# EAGLE design atmega TQFP32 to DIP28 (EAGLE 6.1)
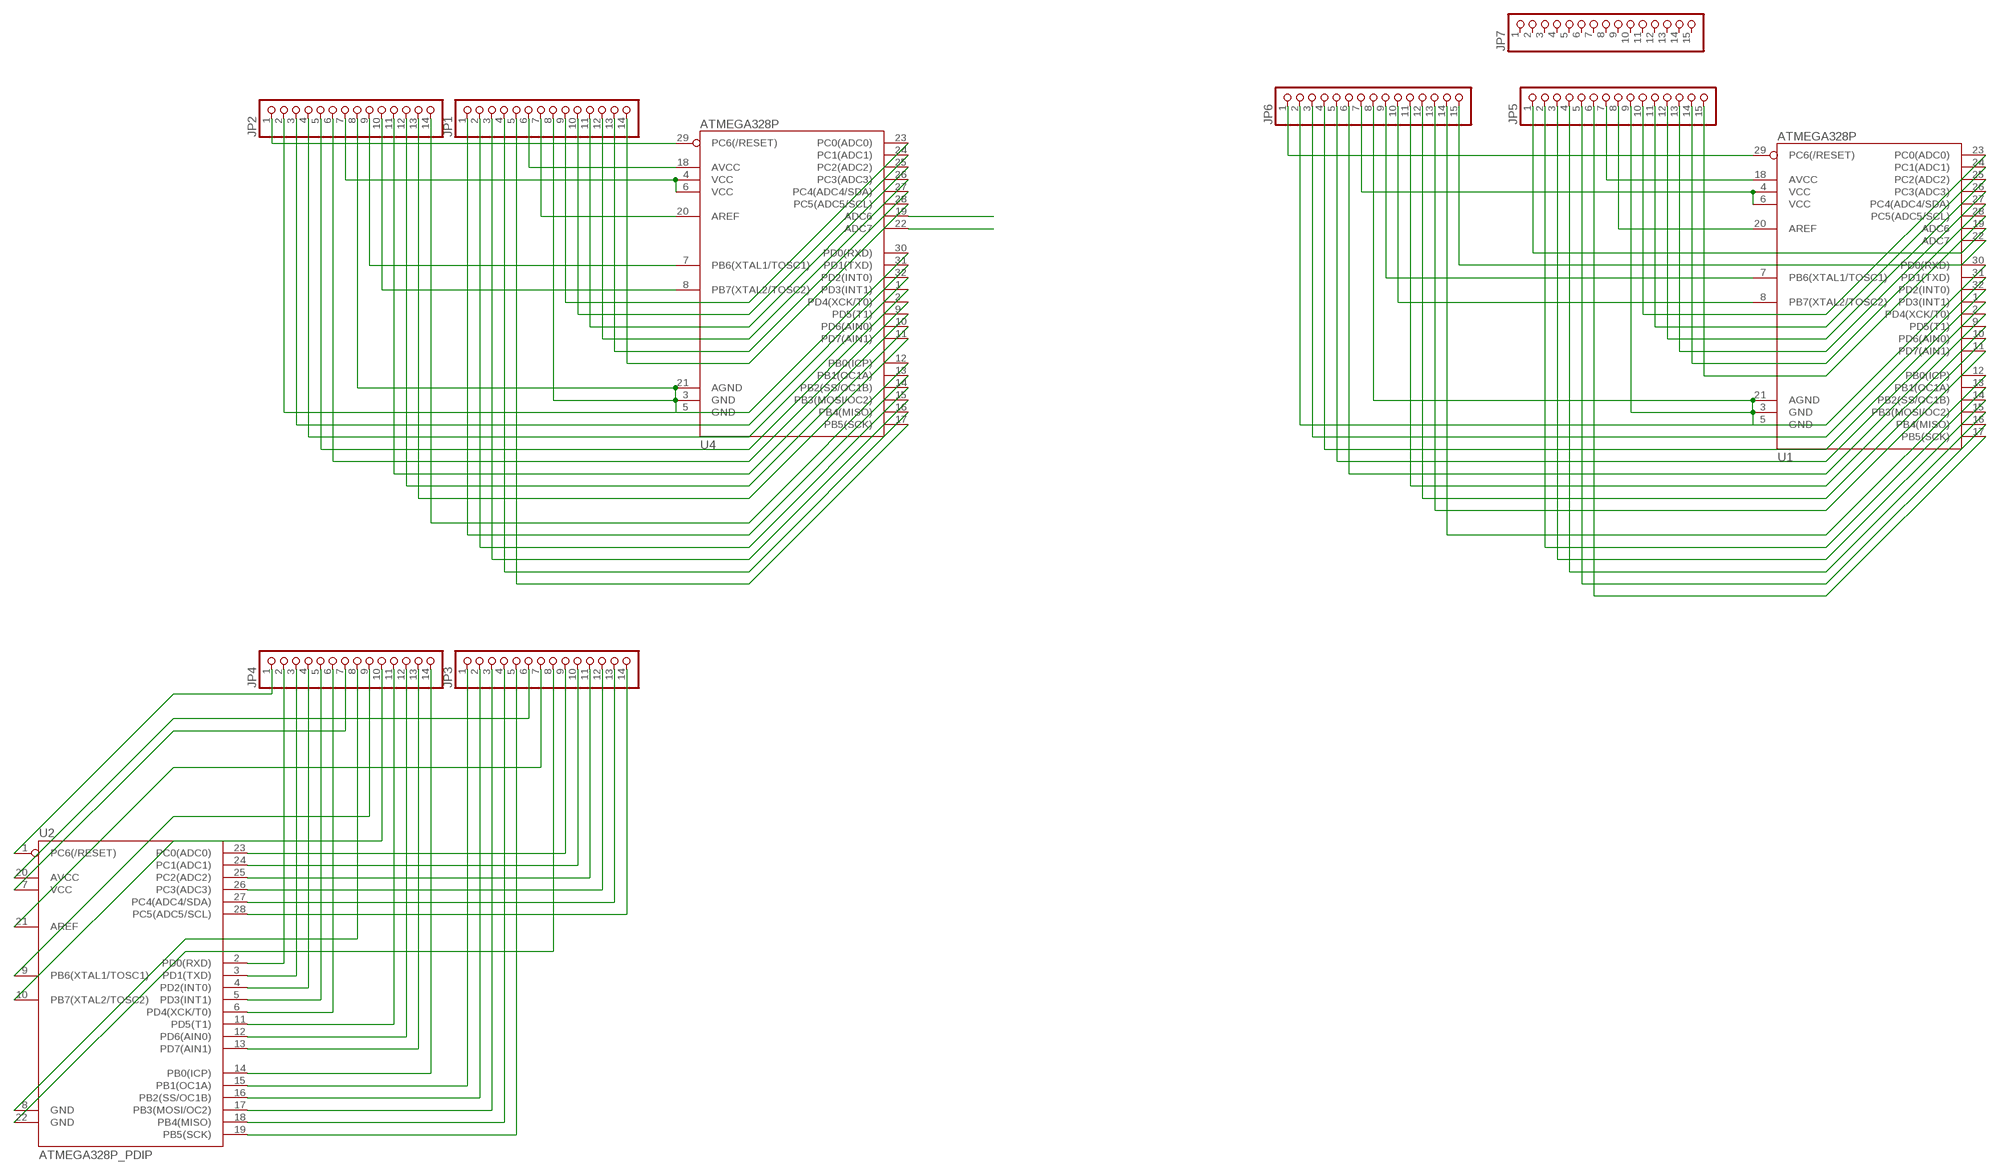
[diagram p0: schematic, sheet 1]

## Parts
JP1  PINHD-1X14  [1X14]
JP2  PINHD-1X14  [1X14]
JP3  PINHD-1X14  [1X14]
JP4  PINHD-1X14  [1X14]
JP5  PINHD-1X15  [1X15]
JP6  PINHD-1X15  [1X15]
JP7  PINHD-1X15  [1X15]
U1  ATMEGA328P  ATMEGA328_SMT  [TQFP32-08]
U2  ATMEGA328P_PDIP  [DIL28-3]
U4  ATMEGA328P  ATMEGA328_SMT  [TQFP32-08]

## Nets
GND: JP1.8 JP2.8 U4.3(GND) U4.5(GND) U4.21(AGND)
GND1: JP5.9 JP6.8 U1.3(GND) U1.5(GND) U1.21(AGND)
N$1: JP2.1 U4.29(PC6(/RESET))
N$2: JP1.6 U4.18(AVCC)
N$3: U4.19(ADC6)
N$4: JP1.7 U4.20(AREF)
N$5: JP2.9 U4.7(PB6(XTAL1/TOSC1))
N$6: JP2.10 U4.8(PB7(XTAL2/TOSC2))
N$7: JP4.1 U2.1(PC6(/RESET))
N$8: U4.22(ADC7)
N$9: JP1.9 U4.23(PC0(ADC0))
N$10: JP1.10 U4.24(PC1(ADC1))
N$11: JP1.11 U4.25(PC2(ADC2))
N$12: JP1.12 U4.26(PC3(ADC3))
N$13: JP1.13 U4.27(PC4(ADC4/SDA))
N$14: JP1.14 U4.28(PC5(ADC5/SCL))
N$15: JP2.2 U4.30(PD0(RXD))
N$16: JP2.3 U4.31(PD1(TXD))
N$17: JP2.4 U4.32(PD2(INT0))
N$18: JP2.5 U4.1(PD3(INT1))
N$19: JP2.6 U4.2(PD4(XCK/T0))
N$20: JP2.11 U4.9(PD5(T1))
N$21: JP2.12 U4.10(PD6(AIN0))
N$22: JP2.13 U4.11(PD7(AIN1))
N$23: JP2.14 U4.12(PB0(ICP))
N$24: JP1.1 U4.13(PB1(OC1A))
N$25: JP1.2 U4.14(PB2(SS/OC1B))
N$26: JP1.3 U4.15(PB3(MOSI/OC2))
N$27: JP1.4 U4.16(PB4(MISO))
N$28: JP1.5 U4.17(PB5(SCK))
N$29: JP3.6 U2.20(AVCC)
N$30: JP4.7 U2.7(VCC)
N$31: JP3.7 U2.21(AREF)
N$32: JP4.9 U2.9(PB6(XTAL1/TOSC1))
N$33: JP4.10 U2.10(PB7(XTAL2/TOSC2))
N$34: JP4.8 U2.8(GND)
N$35: JP3.9 U2.23(PC0(ADC0))
N$36: JP3.10 U2.24(PC1(ADC1))
N$37: JP3.11 U2.25(PC2(ADC2))
N$38: JP3.12 U2.26(PC3(ADC3))
N$39: JP3.13 U2.27(PC4(ADC4/SDA))
N$40: JP3.14 U2.28(PC5(ADC5/SCL))
N$41: JP4.2 U2.2(PD0(RXD))
N$42: JP4.3 U2.3(PD1(TXD))
N$43: JP4.4 U2.4(PD2(INT0))
N$44: JP4.5 U2.5(PD3(INT1))
N$45: JP4.6 U2.6(PD4(XCK/T0))
N$46: JP4.11 U2.11(PD5(T1))
N$47: JP4.12 U2.12(PD6(AIN0))
N$48: JP4.13 U2.13(PD7(AIN1))
N$49: JP4.14 U2.14(PB0(ICP))
N$50: JP3.1 U2.15(PB1(OC1A))
N$51: JP3.2 U2.16(PB2(SS/OC1B))
N$52: JP3.3 U2.17(PB3(MOSI/OC2))
N$53: JP3.4 U2.18(PB4(MISO))
N$54: JP3.5 U2.19(PB5(SCK))
N$55: JP6.1 U1.29(PC6(/RESET))
N$56: JP5.7 U1.18(AVCC)
N$57: JP5.8 U1.20(AREF)
N$58: JP6.9 U1.7(PB6(XTAL1/TOSC1))
N$59: JP6.10 U1.8(PB7(XTAL2/TOSC2))
N$60: JP5.10 U1.23(PC0(ADC0))
N$61: JP5.11 U1.24(PC1(ADC1))
N$62: JP5.12 U1.25(PC2(ADC2))
N$63: JP5.13 U1.26(PC3(ADC3))
N$64: JP5.14 U1.27(PC4(ADC4/SDA))
N$65: JP5.15 U1.28(PC5(ADC5/SCL))
N$66: JP6.2 U1.30(PD0(RXD))
N$67: JP6.3 U1.31(PD1(TXD))
N$68: JP6.4 U1.32(PD2(INT0))
N$69: JP6.5 U1.1(PD3(INT1))
N$70: JP6.6 U1.2(PD4(XCK/T0))
N$71: JP6.11 U1.9(PD5(T1))
N$72: JP6.12 U1.10(PD6(AIN0))
N$73: JP6.13 U1.11(PD7(AIN1))
N$74: JP6.14 U1.12(PB0(ICP))
N$75: JP5.2 U1.13(PB1(OC1A))
N$76: JP5.3 U1.14(PB2(SS/OC1B))
N$77: JP5.4 U1.15(PB3(MOSI/OC2))
N$78: JP5.5 U1.16(PB4(MISO))
N$79: JP5.6 U1.17(PB5(SCK))
N$80: JP5.1 U1.19(ADC6)
N$81: JP6.15 U1.22(ADC7)
N$82: JP3.8 U2.22(GND)
VCC: JP2.7 U4.4(VCC) U4.6(VCC)
VCC1: JP6.7 U1.4(VCC) U1.6(VCC)
Unconnected: JP7.1 JP7.2 JP7.3 JP7.4 JP7.5 JP7.6 JP7.7 JP7.8 JP7.9 JP7.10 JP7.11 JP7.12 JP7.13 JP7.14 JP7.15

## Library data of the parts
JP1-JP4 = pinhead:PINHD-1X14: PIN HEADER
JP5-JP7 = pinhead:PINHD-1X15: PIN HEADER
U1 U4 = SparkFun-DigitalIC:ATMEGA328_SMT: 32-Pin Atmega328 part Commonly used on Arduino compatible boards Available in QFP and QFN packages TQFP is IC-09069 QFN is non-stock; PROD_ID: IC-09069
U2 = SparkFun-DigitalIC:ATMEGA328P_PDIP: uC used in the Arduino 32kb flash, 1k EEPROM, 2k SRAM This is the through-hole version of this chip.

## Board
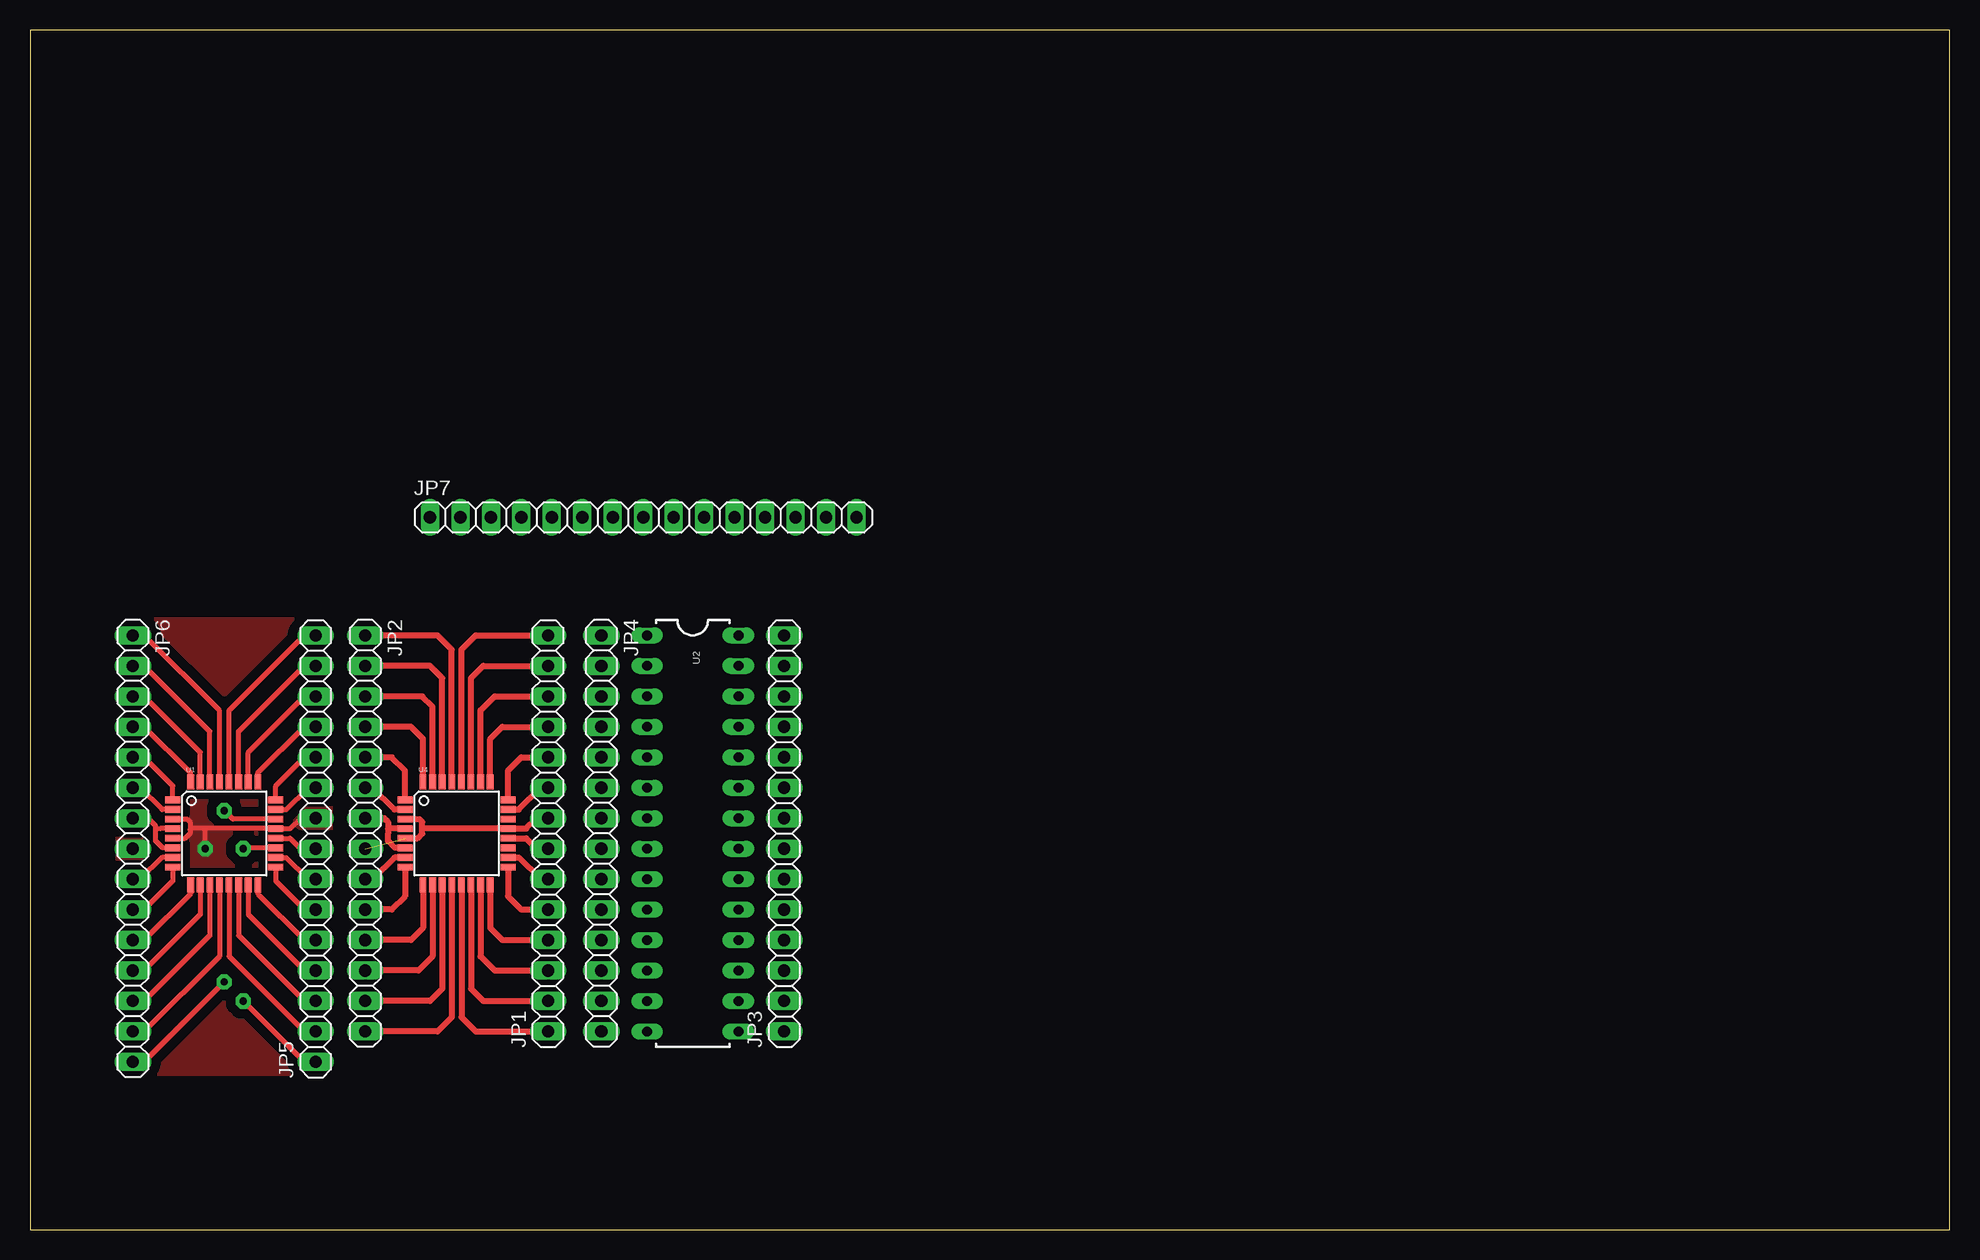
[diagram p1: board, top side]
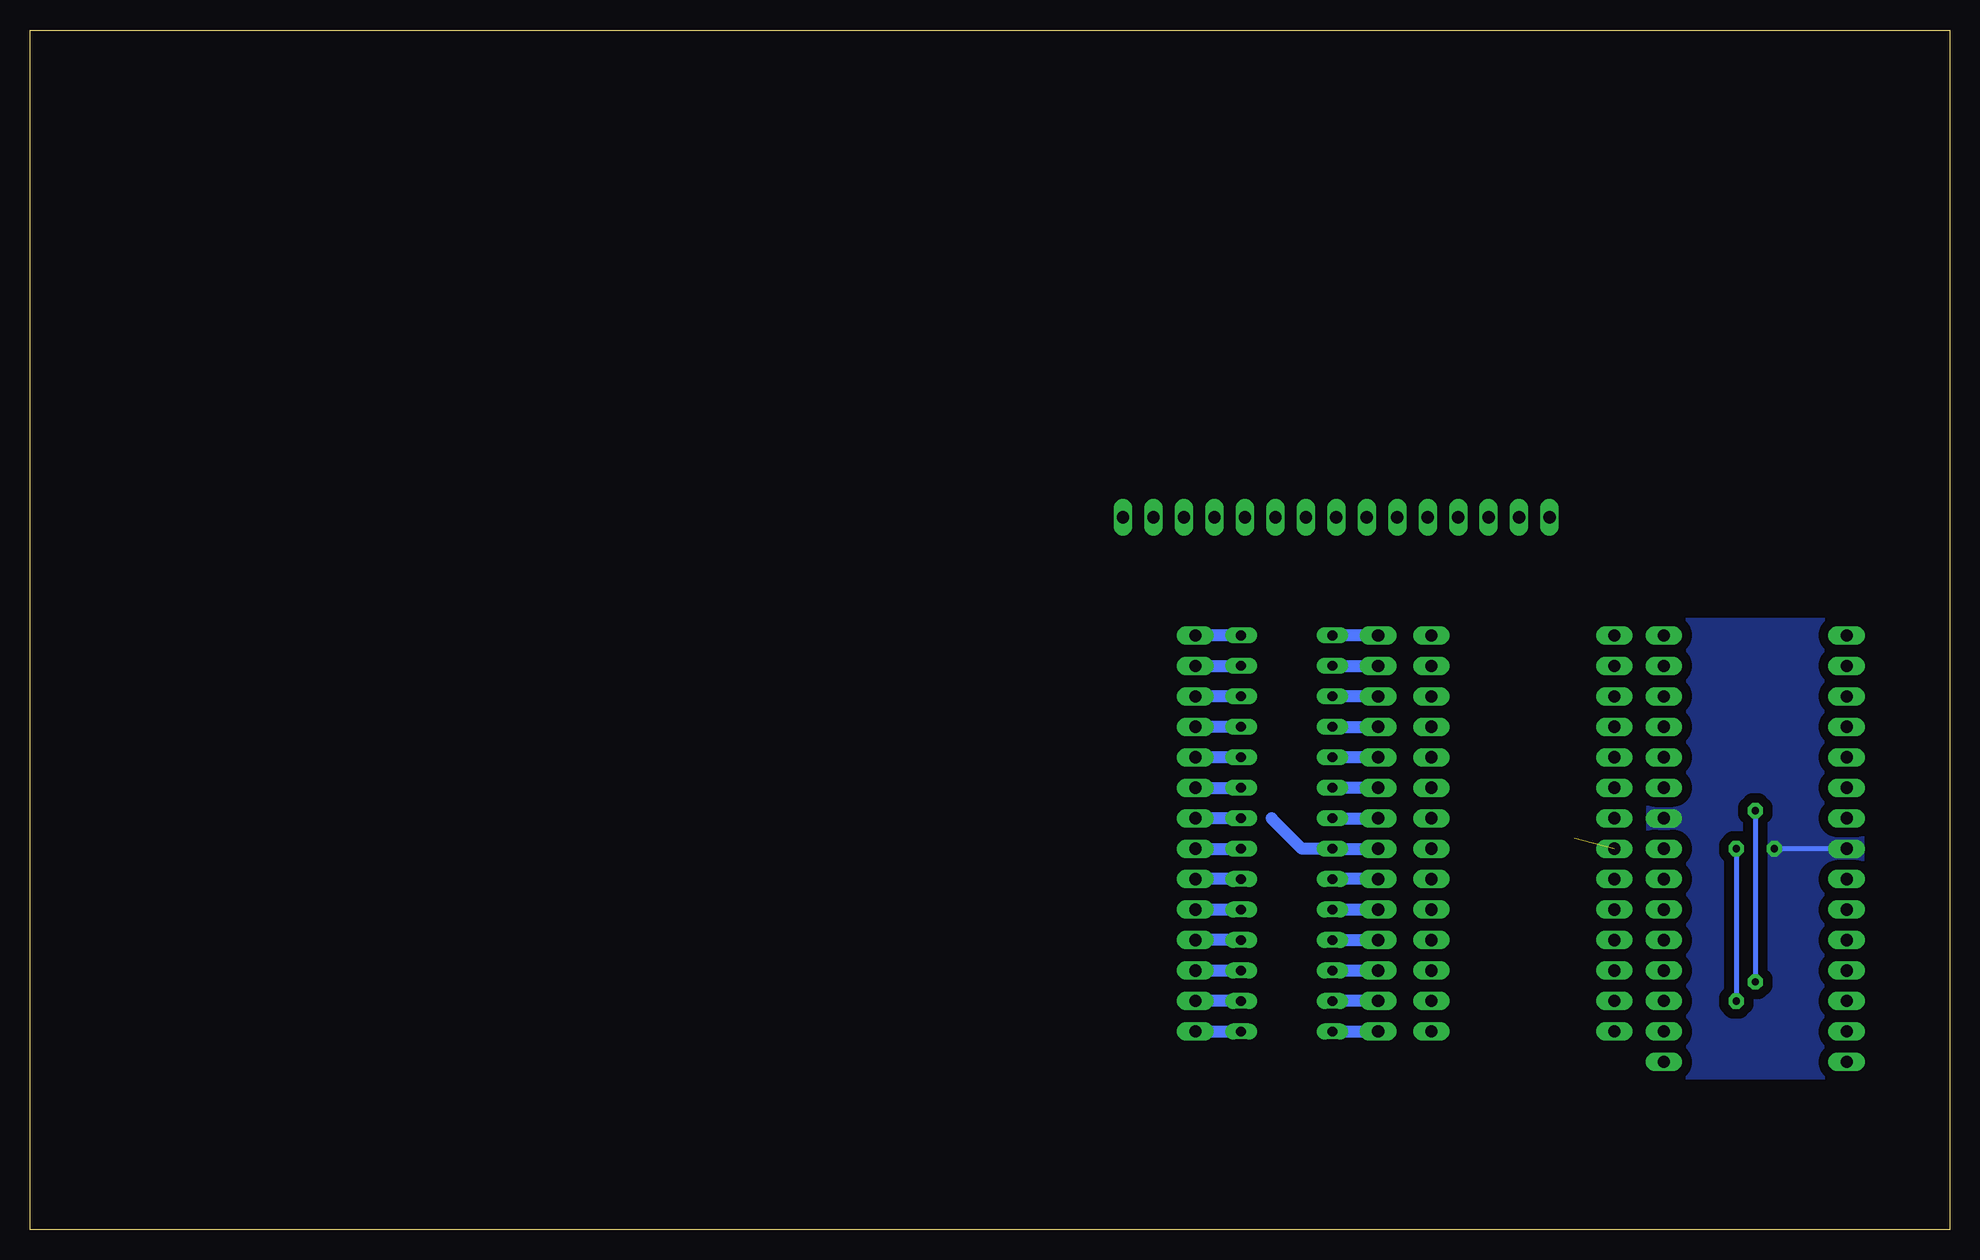
[diagram p2: board, bottom side, seen from below]

Size 160 x 100 mm. Coordinates in mm from the lower left corner, seen from the top.
Outline: 0,0 160,0 160,100 0,100 0,0
Copper layers (1*16): Top 0.035mm / dielectric 1.5mm / Bottom 0.035mm
Design rules: minimum track width 10mil, minimum drill 24mil, track to track 8mil, track to pad 8mil, pad to pad 8mil, via to via 8mil, smd to smd 8mil, copper to edge 40mil, drill to drill 8mil, minimum pad ring 10mil, minimum via ring 8mil, stop-mask expansion 4mil, vias tented up to drill 0mil, thermal gap 10mil

### Footprints (pad centres in the part's own frame; a part is rotated, then mirrored left to right if it is on the bottom)
1X14 = drill 1.016 long: 1 -16.51,0; 2 -13.97,0; 3 -11.43,0; 4 -8.89,0; 5 -6.35,0; 6 -3.81,0; 7 -1.27,0; 8 1.27,0; 9 3.81,0; 10 6.35,0; 11 8.89,0; 12 11.43,0; 13 13.97,0; 14 16.51,0
1X15 = drill 1.016 long: 1 -17.78,0; 2 -15.24,0; 3 -12.7,0; 4 -10.16,0; 5 -7.62,0; 6 -5.08,0; 7 -2.54,0; 8 0,0; 9 2.54,0; 10 5.08,0; 11 7.62,0; 12 10.16,0; 13 12.7,0; 14 15.24,0; 15 17.78,0
TQFP32-08 = smd 1.27 x 0.559: 1 -4.293,2.8; 2 -4.293,2; 3 -4.293,1.2; 4 -4.293,0.4; 5 -4.293,-0.4; 6 -4.293,-1.2; 7 -4.293,-2; 8 -4.293,-2.8; 17 4.293,-2.8; 18 4.293,-2; 19 4.293,-1.2; 20 4.293,-0.4; 21 4.293,0.4; 22 4.293,1.2; 23 4.293,2; 24 4.293,2.8 | smd 0.559 x 1.27: 9 -2.8,-4.293; 10 -2,-4.293; 11 -1.2,-4.293; 12 -0.4,-4.293; 13 0.4,-4.293; 14 1.2,-4.293; 15 2,-4.293; 16 2.8,-4.293; 25 2.8,4.293; 26 2,4.293; 27 1.2,4.293; 28 0.4,4.293; 29 -0.4,4.293; 30 -1.2,4.293; 31 -2,4.293; 32 -2.8,4.293
DIL28-3 = drill 0.813 long: 1 -16.51,-3.81; 2 -13.97,-3.81; 3 -11.43,-3.81; 4 -8.89,-3.81; 5 -6.35,-3.81; 6 -3.81,-3.81; 7 -1.27,-3.81; 8 1.27,-3.81; 9 3.81,-3.81; 10 6.35,-3.81; 11 8.89,-3.81; 12 11.43,-3.81; 13 13.97,-3.81; 14 16.51,-3.81; 15 16.51,3.81; 16 13.97,3.81; 17 11.43,3.81; 18 8.89,3.81; 19 6.35,3.81; 20 3.81,3.81; 21 1.27,3.81; 22 -1.27,3.81; 23 -3.81,3.81; 24 -6.35,3.81; 25 -8.89,3.81; 26 -11.43,3.81; 27 -13.97,3.81; 28 -16.51,3.81

### Placement (x,y rotation side)
JP1  43.18,33.02 90 top
JP2  27.94,33.02 270 top
JP3  62.87,33.02 90 top
JP4  47.62,33.02 270 top
JP5  23.81,31.75 90 top
JP6  8.57,31.75 270 top
JP7  51.12,59.37 0 top
U1  16.19,33.02 0 top
U2  55.24,33.02 270 top
U4  35.56,33.02 0 top

### Tracks (layer width: path | path; a pad name or v marks a point on that pad's centre or on a via)
GND  (1 unrouted)
  Top 0.508: U4.3 32.45,34.22 32.7,33.97 32.7,33.34 | U4.5 32.3,32.62 32.7,33.02 32.7,33.34 | 32.7,33.34 32.78,33.42 U4.21 41.36,33.42 42.23,34.29 JP1.8
GND1  (via drill 0.6 pad 1.27)
  Top 0.406: 14.61,33.42 U1.21 21.67,33.42 22.54,34.29 JP5.9 | 14.61,33.42 13.42,33.42 13.34,33.34 | U1.3 13.09,34.22 13.34,33.97 13.34,33.34 | 13.34,33.34 13.34,33.02 12.94,32.62 U1.5 | v14.61,31.75 14.61,33.42
  Bottom 0.406: JP6.8 v14.61,31.75
  pour Bottom (isolate 0.813, no thermals): 7.3,12.7 25.08,12.7 25.08,50.8 7.3,50.8
  pour Top (isolate 0.813, no thermals): 7.3,13.02 25.08,13.02 25.08,50.8 7.3,50.8
N$1
  Top 0.508: U4.29 35.16,48.34 33.97,49.53 JP2.1
N$2
  Top 0.508: U4.18 40.73,31.02 42.55,29.21 JP1.6
N$4
  Top 0.508: U4.20 41.36,32.62 42.23,31.75 JP1.7
N$5
  Top 0.508: U4.7 30.39,31.02 28.57,29.21 JP2.9
N$6
  Top 0.508: U4.8 31.27,27.77 30.16,26.67 JP2.10
N$7
  Bottom 1.016: JP4.1 U2.1
N$9
  Top 0.508: U4.23 40.73,35.02 42.55,36.83 JP1.9
N$10
  Top 0.508: U4.24 39.85,38.27 40.96,39.37 JP1.10
N$11
  Top 0.508: U4.25 38.36,40.9 39.37,41.91 JP1.11
N$12
  Top 0.508: U4.26 37.56,43.27 38.73,44.45 JP1.12
N$13
  Top 0.508: U4.27 36.76,45.97 37.78,46.99 JP1.13
N$14
  Top 0.508: U4.28 35.96,48.34 37.15,49.53 JP1.14
N$15
  Top 0.508: U4.30 34.36,45.97 33.34,46.99 JP2.2
N$16
  Top 0.508: U4.31 33.56,43.59 32.7,44.45 JP2.3
N$17
  Top 0.508: U4.32 32.76,40.9 31.75,41.91 JP2.4
N$18
  Top 0.508: U4.1 31.27,38.27 30.16,39.37 JP2.5
N$19
  Top 0.508: U4.2 30.39,35.02 28.57,36.83 JP2.6
N$20
  Top 0.508: U4.9 32.76,25.14 31.75,24.13 JP2.11
N$21
  Top 0.508: U4.10 33.56,22.77 32.38,21.59 JP2.12
N$22
  Top 0.508: U4.11 34.36,20.07 33.34,19.05 JP2.13
N$23
  Top 0.508: U4.12 35.16,17.7 33.97,16.51 JP2.14
N$24
  Top 0.508: U4.13 35.96,17.7 37.15,16.51 JP1.1
N$25
  Top 0.508: U4.14 36.76,20.07 37.78,19.05 JP1.2
N$26
  Top 0.508: U4.15 37.56,22.77 38.73,21.59 JP1.3
N$27
  Top 0.508: U4.16 38.36,25.14 39.37,24.13 JP1.4
N$28
  Top 0.508: U4.17 39.85,27.77 40.96,26.67 JP1.5
N$29
  Bottom 1.016: U2.20 JP3.6
N$30
  Bottom 1.016: U2.7 JP4.7
N$31
  Bottom 1.016: JP3.7 U2.21
N$32
  Bottom 1.016: JP4.9 U2.9
N$33
  Bottom 1.016: U2.10 JP4.10
N$34
  Bottom 1.016: 56.52,34.29 53.98,31.75 U2.8 JP4.8
N$35
  Bottom 1.016: JP3.9 U2.23
N$36
  Bottom 1.016: U2.24 JP3.10
N$37
  Bottom 1.016: U2.25 JP3.11
N$38
  Bottom 1.016: U2.26 JP3.12
N$39
  Bottom 1.016: JP3.13 U2.27
N$40
  Bottom 1.016: U2.28 JP3.14
N$41
  Bottom 1.016: U2.2 JP4.2
N$42
  Bottom 1.016: JP4.3 U2.3
N$43
  Bottom 1.016: U2.4 JP4.4
N$44
  Bottom 1.016: JP4.5 U2.5
N$45
  Bottom 1.016: JP4.6 U2.6
N$46
  Bottom 1.016: U2.11 JP4.11
N$47
  Bottom 1.016: U2.12 JP4.12
N$48
  Bottom 1.016: JP4.13 U2.13
N$49
  Bottom 1.016: U2.14 JP4.14
N$50
  Bottom 1.016: JP3.1 U2.15
N$51
  Bottom 1.016: U2.16 JP3.2
N$52
  Bottom 1.016: JP3.3 U2.17
N$53
  Bottom 1.016: U2.18 JP3.4
N$54
  Bottom 1.016: JP3.5 U2.19
N$55
  Top 0.406: U1.29 15.79,43.26 9.53,49.53 JP6.1
N$56
  Top 0.406: U1.18 21.37,31.02 23.18,29.21 JP5.7
N$57
  Top 0.406: U1.20 21.67,32.62 22.54,31.75 JP5.8
N$58
  Top 0.406: U1.7 11.02,31.02 9.21,29.21 JP6.9
N$59
  Top 0.406: U1.8 11.9,29.05 9.53,26.67 JP6.10
N$60
  Top 0.406: U1.23 21.37,35.02 23.18,36.83 JP5.10
N$61
  Top 0.406: U1.24 20.48,36.99 22.86,39.37 JP5.11
N$62
  Top 0.406: U1.25 18.99,38.04 22.86,41.91 JP5.12
N$63
  Top 0.406: U1.26 18.19,39.78 22.86,44.45 JP5.13
N$64
  Top 0.406: U1.27 17.39,41.52 22.86,46.99 JP5.14
N$65
  Top 0.406: U1.28 16.59,43.26 22.86,49.53 JP5.15
N$66
  Top 0.406: U1.30 14.99,41.52 9.53,46.99 JP6.2
N$67
  Top 0.406: U1.31 14.19,39.78 9.53,44.45 JP6.3
N$68
  Top 0.406: U1.32 13.39,38.04 9.53,41.91 JP6.4
N$69
  Top 0.406: U1.1 11.9,36.99 9.53,39.37 JP6.5
N$70
  Top 0.406: U1.2 11.02,35.02 9.21,36.83 JP6.6
N$71
  Top 0.406: U1.9 13.39,28 9.53,24.13 JP6.11
N$72
  Top 0.406: U1.10 14.19,26.26 9.53,21.59 JP6.12
N$73
  Top 0.406: U1.11 14.99,24.52 9.53,19.05 JP6.13
N$74
  Top 0.406: U1.12 15.79,22.78 9.53,16.51 JP6.14
N$75
  Top 0.406: U1.13 16.59,22.78 22.86,16.51 JP5.2
N$76
  Top 0.406: U1.14 17.39,24.52 22.86,19.05 JP5.3
N$77
  Top 0.406: U1.15 18.19,26.26 22.86,21.59 JP5.4
N$78
  Top 0.406: U1.16 18.99,28 22.86,24.13 JP5.5
N$79
  Top 0.406: U1.17 20.48,29.05 22.86,26.67 JP5.6
N$80  (via drill 0.6 pad 1.27)
  Top 0.406: U1.19 17.85,31.82 v17.78,31.75 | v17.78,19.05 22.86,13.97 JP5.1
  Bottom 0.406: v17.78,31.75 v17.78,19.05
N$81  (via drill 0.6 pad 1.27)
  Top 0.406: U1.22 16.9,34.22 v16.19,34.92 | v16.19,20.64 9.53,13.97 JP6.15
  Bottom 0.406: v16.19,34.92 v16.19,20.64
N$82
  Bottom 1.016: U2.22 JP3.8
VCC
  Top 0.508: U4.6 30.41,31.82 29.84,32.38 29.84,33.02 29.84,33.42 | U4.4 29.84,33.42 | JP2.7 29.53,34.29 29.84,33.97 29.84,33.42
VCC1
  Top 0.406: U1.6 11.04,31.82 10.48,32.38 10.48,33.34 | 10.48,33.34 10.48,33.66 9.84,34.29 JP6.7 | U1.4 10.88,33.42 10.48,33.34